# EAGLE design airwisk_bez_transisotru (EAGLE 7.7.0)
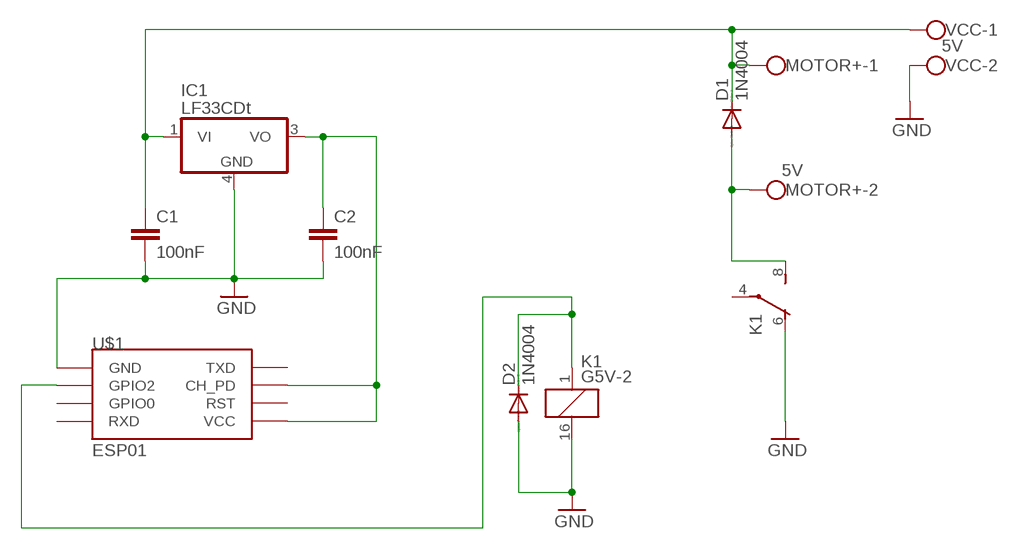
[diagram p0: schematic, sheet 1]

## Parts
C1  100nF  C-EU025-025X050  [C025-025X050]
C2  100nF  C-EU025-025X050  [C025-025X050]
D1  1N4004  [DO41-10]
D2  1N4004  [DO41-10]
IC1  LF33CDt  MC78M05ABDT  [DPACK_3]
K1  G5V-2  [G5V-2]
MOTOR+  5V  W237-102  [W237-102]
U$1  ESP01  [ESP01]
VCC  5V  W237-102  [W237-102]

## Nets
GND: C1.2 C2.2 D2.A IC1.4(GND) K1.6(1:O) K1.16 U$1.GND VCC.2
N$1: C1.1 D1.C IC1.1(VI) MOTOR+.1 VCC.1
N$2: D1.A K1.8(1:S) MOTOR+.2
N$4: D2.C K1.1 U$1.GPIO2
N$5: C2.1 IC1.3(VO) U$1.CH_PD U$1.VCC
Unconnected: K1.4(1:P) K1.9(2:S) K1.11(2:O) K1.13(2:P) U$1.GPIO0 U$1.RST U$1.RX(RXD) U$1.TX(TXD)

## Library data of the parts
C1 C2 = rcl:C-EU: CAPACITOR, European symbol
D1 D2 = diode:1N4004: DIODE general purpose rectifier, 1 A
IC1 = linear:MC78M: 500 mA Positive Voltage Regulators Source: Data sheet <http://www.onsemi.com/pub_link/Collateral/MC78M00-D.PDF>
K1 = relay:G5V-2: OMRON PCB Relay Source: http://www.omron.com/ecb/products/pdf/en-g5v2.pdf; MPN: G5V-2 5DC; OC_FARNELL: 9949488; OC_NEWARK: 78K5703
MOTOR+ VCC = con-wago-500:W237-102: WAGO SCREW CLAMP; MPN: 237-102; OC_FARNELL: unknown; OC_NEWARK: 70K9898
U$1 = esp8266modules:ESP01: ESP8266 Wifi module 01

## Net classes
0 default: width 0.406 mm
1 ground: width 0.61 mm

## Board
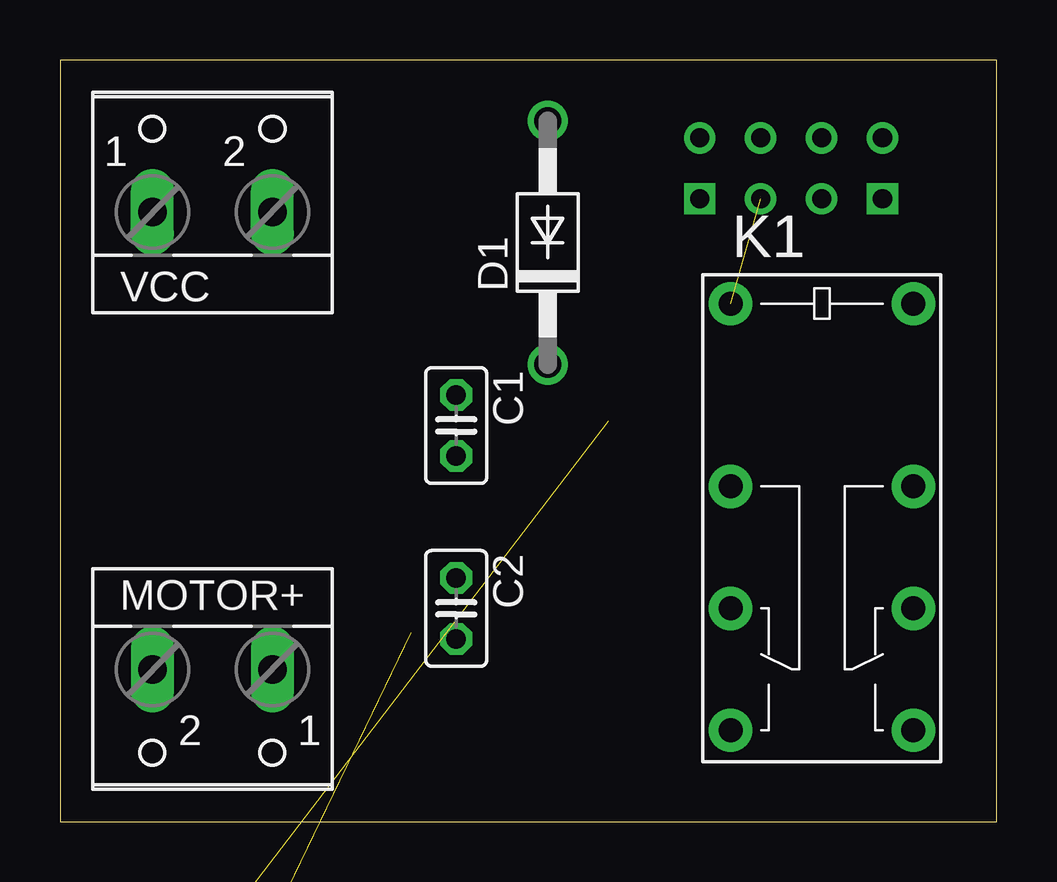
[diagram p1: board, top side]
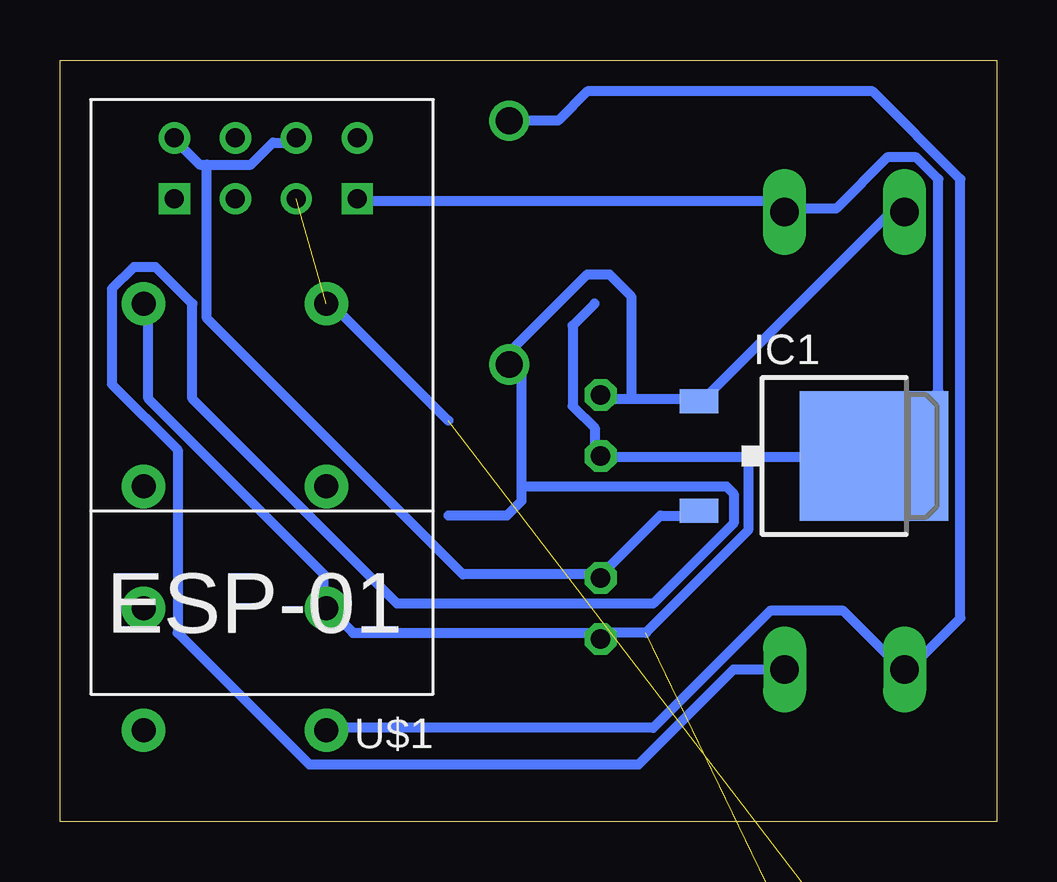
[diagram p2: board, bottom side, seen from below]

Size 39.04 x 31.74 mm. Coordinates in mm from the lower left corner, seen from the top.
Outline: 0,0 39.04,0 39.04,31.74 0,31.74 0,0
Copper layers (1*16): Top 0.035mm / dielectric 1.5mm / Bottom 0.035mm
Design rules "default": minimum track width 10mil, minimum drill 24mil, track to track 8mil, track to pad 8mil, pad to pad 8mil, via to via 8mil, smd to smd 8mil, copper to edge 40mil, drill to drill 8mil, minimum pad ring 10mil, minimum via ring 8mil, stop-mask expansion 4mil, vias tented up to drill 0mil, thermal gap 10mil

### Footprints (pad centres in the part's own frame; a part is rotated, then mirrored left to right if it is on the bottom)
C025-025X050 = drill 0.813 octagon: 1 -1.27,0; 2 1.27,0
DO41-10 = drill 1.118: A 5.08,0; C -5.08,0
DPACK_3 = smd 1 x 1.6: 1 -2.28,-4.8; 3 2.28,-4.8 | smd 5.4 x 6.2: 4 0,2.5
G5V-2 = drill 1 pad 1.8: 1 -8.89,-3.81; 4 -1.27,-3.81; 6 3.81,-3.81; 8 8.89,-3.81; 9 8.89,3.81; 11 3.81,3.81; 13 -1.27,3.81; 16 -8.89,3.81
W237-102 = drill 1.194 long: 1 -2.5,-1.27; 2 2.5,-1.27
ESP01 = drill 0.8: CH_PD -1.285,-8.178; GPIO0 1.255,-5.638; GPIO2 -1.285,-5.638; RST 1.255,-8.178; TX -3.825,-8.178; VCC 3.795,-8.178 | drill 0.8 square: GND -3.825,-5.638; RX 3.795,-5.638

### Placement (x,y rotation side)
C1  16.51,16.51 270 top
C2  16.51,8.89 270 top
D1  20.32,24.13 90 top
D2  -10.16,-33.02 0 top  (outside the outline)
DRILEGEND  [DRILEGEND]  -5.21,-9 0 top  (outside the outline)
IC1  7.62,15.24 270 bottom
K1  31.75,12.7 270 top
MOTOR+  6.35,5.08 180 top
U$1  30.48,20.32 180 bottom
VCC  6.35,26.67 0 top

### Tracks (layer width: path | path; a pad name or v marks a point on that pad's centre or on a via)
GND  (1 unrouted)
  Bottom 0.406: K1.16 35.36,21.59 35.36,17.63 28.04,10.31 28.04,9.09 K1.6 27.74,8.79 26.82,7.87 16.76,7.87 C2.2 16.46,7.87 14.63,7.87 10.36,12.14 10.36,15.19 | U$1.GND 26.52,25.86 9.45,25.86 9.14,25.55 VCC.2 8.84,25.55 6.71,25.55 4.57,27.69 3.35,27.69 2.44,26.77 2.44,17.93 4.88,15.49 IC1.4 5.18,15.19 10.36,15.19 | 16.76,21.59 17.68,20.68 17.68,17.32 16.76,16.41 16.76,15.49 C1.2 16.46,15.19 10.36,15.19
N$1
  Bottom 0.406: 15.24,17.63 16.46,17.63 C1.1 | 15.24,17.63 12.5,17.63 IC1.1 12.19,17.63 4.57,25.25 3.96,25.25 VCC.1 | 22.86,12.75 20.42,12.75 19.81,13.36 19.81,13.97 | 19.81,13.97 19.81,18.54 D1.C 20.12,19.15 20.12,19.76 17.07,22.81 16.15,22.81 15.24,21.9 15.24,17.63 | MOTOR+.1 10.97,6.35 14.94,2.39 28.65,2.39 34.14,7.87 34.14,15.49 36.88,18.24 36.88,22.2 35.97,23.11 35.05,23.11 33.53,21.59 33.53,17.63 24.99,9.09 14.33,9.09 10.97,12.45 10.97,13.66 11.28,13.97 19.81,13.97
N$2
  Bottom 0.406: D1.A 18.29,29.21 17.07,30.43 5.18,30.43 1.52,26.77 1.52,8.48 3.66,6.35 MOTOR+.2 3.96,6.35 6.4,8.79 9.45,8.79 14.33,3.91 27.74,3.91 K1.8
N$4  (2 unrouted)
  Bottom 0.406: 22.86,16.71 27.74,21.59 K1.1
N$5
  Bottom 0.406: 32.92,27.38 33.22,27.38 34.14,28.3 U$1.VCC | 32.92,27.38 31.09,27.38 30.18,28.3 29.26,28.3 U$1.CH_PD | IC1.3 12.5,12.75 14.02,12.75 16.46,10.31 C2.1 16.76,10.31 22.25,10.31 32.92,20.98 32.92,27.38

### Text on the board
DrillLegend: LAYER-STACK
DrillLegend_01-16: 01-16